# Altium schematic sheet Sheet1.SchDoc
size A
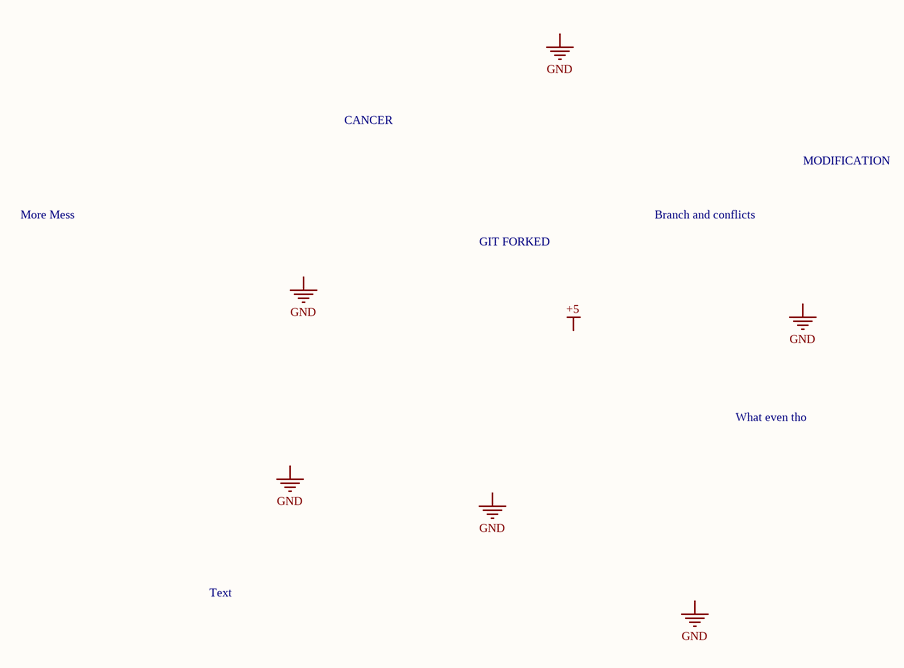
[diagram p0: Sheet1.SchDoc]

## Notes on the sheet
- CANCER
- More Mess
- Branch and conflicts
- MODIFICATION
- GIT FORKED
- What even tho
- Text
- Labels drawn without touching a wire or pin: +5, GND